# Altium schematic sheet ice40.SchDoc: <Enter Sheet Title>
size Letter; Organization: NewAE Technology Inc.; Address1: 1083 Queen St., Suite 196; Address2: Halifax; Address3: NS; Address4: Canada B3H 0B2; SheetApproved: NO
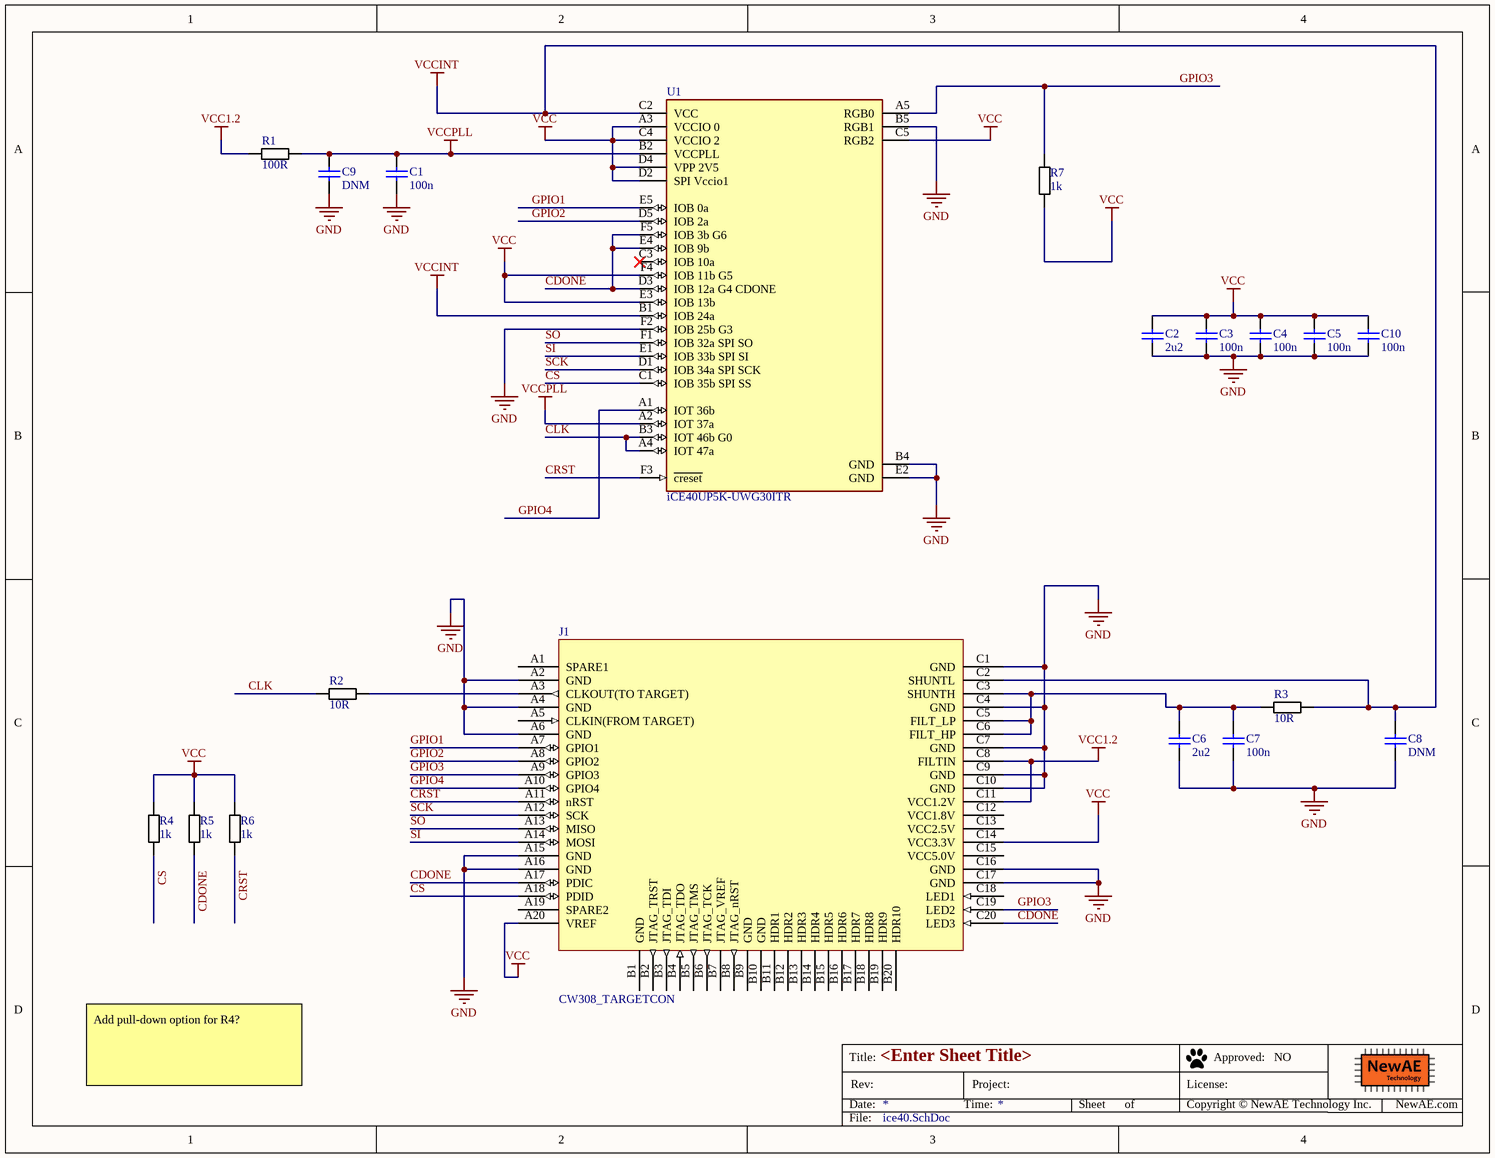
[diagram p0: ice40.SchDoc]

## Parts
C1  100n  [CAPC0603_M]
C2  2u2  [CAPC0603_M]
C3  100n  [CAPC0603_M]
C4  100n  [CAPC0603_M]
C5  100n  [CAPC0603_M]
C6  2u2  [CAPC0603_M]
C7  100n  [CAPC0603_M]
C8  DNM  [CAPC0603_M]
C9  DNM  [CAPC0603_M]
C10  100n  [CAPC0603_M]
J1  CW308_TARGETCON  [CW308_TBOARD_CONN]
R1  100R  [RESC1608X55N]
R2  10R  [RESC1608X55N]
R3  10R  [RESC1608X55N]
R4  1k  [RESC1608X55N]
R5  1k  [RESC1608X55N]
R6  1k  [RESC1608X55N]
R7  1k  [RESC1608X55N]
U1  iCE40UP5K-UWG30ITR  [FP-WLSC-30-MFG]

## Nets
GND: C1.2 C2.2 C3.2 C4.2 C5.2 C6.2 C7.2 C8.2 C9.2 C10.2 J1.A2(GND) J1.A4(GND) J1.A6(GND) J1.A15(GND) J1.A16(GND) J1.C1(GND) J1.C4(GND) J1.C7(GND) J1.C9(GND) J1.C10(GND) J1.C16(GND) J1.C17(GND) U1.B4(GND) U1.B5(RGB1) U1.E2(GND) U1.F2(IOB_25b_G3)
VCC: C2.1 C3.1 C4.1 C5.1 C10.1 J1.A20(VREF) J1.C14(VCC3.3V) R4.1 R5.1 R6.1 R7.2 U1.A3(VCCIO_0) U1.C4(VCCIO_2) U1.C5(RGB2) U1.D2(SPI_Vccio1) U1.D4(VPP_2V5) U1.E3(IOB_13b) U1.F4(IOB_11b_G5)
VCC1.2: J1.C8(FILTIN) J1.C11(VCC1.2V) R1.1
VCCINT: C8.1 J1.C2(SHUNTL) R3.2 U1.B1(IOB_24a) U1.C2(VCC)
VCCPLL: C1.1 C9.1 R1.2 U1.A2(IOT_37a) U1.B2(VCCPLL)
CDONE: J1.A17(PDIC) J1.C20(LED3) R5.2 U1.D3(IOB_12a_G4_CDONE) U1.E4(IOB_9b) U1.F5(IOB_3b_G6)
CLK: R2.1 U1.A4(IOT_47a) U1.B3(IOT_46b_G0)
CRST: J1.A11(nRST) R6.2 U1.F3(~{creset})
CS: J1.A18(PDID) R4.2 U1.C1(IOB_35b_SPI_SS)
GPIO1: J1.A7(GPIO1) U1.E5(IOB_0a)
GPIO2: J1.A8(GPIO2) U1.D5(IOB_2a)
GPIO3: J1.A9(GPIO3) J1.C19(LED2) R7.1 U1.A5(RGB0)
GPIO4: J1.A10(GPIO4) U1.A1(IOT_36b)
SCK: J1.A12(SCK) U1.D1(IOB_34a_SPI_SCK)
SI: J1.A14(MOSI) U1.E1(IOB_33b_SPI_SI)
SO: J1.A13(MISO) U1.F1(IOB_32a_SPI_SO)
NetC6_1: C6.1 C7.1 J1.C3(SHUNTH) J1.C5(FILT_LP) J1.C6(FILT_HP) R3.1
NetJ1_A3: J1.A3(CLKOUT(TO_TARGET)) R2.2

Not connected (* = marked no-connect by the designer): J1 A1(SPARE1) A5(CLKIN(FROM_TARGET)) A19(SPARE2) B1(GND) B2(JTAG_TRST) B3(JTAG_TDI) B4(JTAG_TDO) B5(JTAG_TMS) B6(JTAG_TCK) B7(JTAG_VREF) B8(JTAG_nRST) B9(GND) B10(GND) B11(HDR1) B12(HDR2) B13(HDR3) B14(HDR4) B15(HDR5) B16(HDR6) B17(HDR7) B18(HDR8) B19(HDR9) B20(HDR10) C12(VCC1.8V) C13(VCC2.5V) C15(VCC5.0V) C18(LED1); U1 C3(IOB_10a)*

## Notes on the sheet
- Add pull-down option for R4?
- Title:
- Date:
- Rev:
- Time:
- Project:
- Sheet
- of
- License:
- Copyright © NewAE Technology Inc.
- Approved:
- NewAE.com
- File:

## Library data of the parts
C1 C3-C5 C7 C10 = CCHIP-100n-0603: 100n, 0603; Manufacture 1: Kemet; Manufacture Part Number 1: C0603C104K5RACTU; Component Group: Capacitor; Case-EIA: 0603; Case-Metric: 1608; Rated Voltage: 50VDC; Part Number: CCHIP-100n-0603; Footprint: 0603; Pin Count: 2; Supplier 1: Digi-Key; Supplier Part Number 1: 399-5089-2-ND; Value: 100n; Mounting Technology: SMT; Component Kind: Standard; Component Type: Standard
C2 C6 = CCHIP-2u2-0603: 2u2, 0603; Manufacture 1: Samsung; Manufacture Part Number 1: CL10B225KP8NNNC; Component Group: Capacitor; Case-EIA: 0603; Case-Metric: 1608; Rated Voltage: 10VDC; Part Number: CCHIP-2u2-0603; Footprint: 0603; Pin Count: 2; Supplier 1: Digi-Key; Supplier Part Number 1: 1276-1134-1-ND; Value: 2u2; Mounting Technology: SMT; Component Kind: Standard; Component Type: Standard
C8 C9 = CCHIP-DNM-0603: DNM, 0603; Component Group: Capacitor; Case-EIA: 0603; Part Number: CCHIP-DNM-0603; Footprint: 0603; Pin Count: 2; Value: DNM; Mounting Technology: SMT; Component Kind: Standard; Component Type: Standard
J1 = CW308_TBOARD: CW308 "Standard" Target Board Connector; Component Group: Mechanical; Pitch: 2.54mm; Part Number: CW308_TBOARD; Pin Count: 60; Mounting Technology: Through-hole; Component Kind: Standard; Component Type: Standard
R1 = RCHIP-100R-0603: 100R res, 0603, 1%, 1/10W; Manufacture 1: Yageo; Manufacture Part Number 1: RC0603FR-07100RL; Component Group: Resistor; Case-EIA: 0603; Case-Metric: 1608; Rated Power: 0.1W; Rated Voltage: 75VDC; Part Number: RCHIP-100R-0603; Footprint: 0603; Pin Count: 2; Supplier 1: Digi-Key; Supplier Part Number 1: 311-100HRCT-ND; Value: 100R; Tolerance: 1%; Mounting Technology: SMT; Temperature Range: -55C to 155C; Component Kind: Standard; Component Type: Standard
R2 R3 = RCHIP-10R-0603: 10R res, 0603, 1%, 1/10W; Manufacture 1: Yageo; Manufacture Part Number 1: RC0603FR-0710RL; Component Group: Resistor; Case-EIA: 0603; Case-Metric: 1608; Rated Power: 0.1W; Rated Voltage: 75VDC; Part Number: RCHIP-10R-0603; Footprint: 0603; Pin Count: 2; Supplier 1: Digi-Key; Supplier Part Number 1: 311-10.0HRCT-ND; Value: 10R; Tolerance: 1%; Mounting Technology: SMT; Temperature Range: -55C to 155C; Component Kind: Standard; Component Type: Standard
R4-R7 = RCHIP-1K-0603: 1k res, 0603, 1%, 1/10W; Manufacture 1: Yageo; Manufacture Part Number 1: RC0603FR-071KL; Component Group: Resistor; Case-EIA: 0603; Case-Metric: 1608; Rated Power: 0.1W; Rated Voltage: 75VDC; Part Number: RCHIP-1K-0603; Footprint: 0603; Pin Count: 2; Supplier 1: Digi-Key; Supplier Part Number 1: 311-1.00KHRCT-ND; Value: 1k; Tolerance: 1%; Mounting Technology: SMT; Temperature Range: -55C to 155C; Component Kind: Standard; Component Type: Standard
U1 = CMP-17932-000002-1: CE40-ULTRAPLUS, 5280 LUTS, 1.2V; Manufacturer: Lattice Semiconductor; Frequency: 185MHz; Max Junction Temp: +100°C; Propagation Delay: 9ns; Min Supply Voltage: 1.14V; Standoff Height: 0.14mm; Number Of I/Os: 21; Ram Size: 1024Kbits; Number Of Logic Blocks: 660; Max Supply Voltage: 3.46V; Number Of Logic Elements Cells: 5280; ComponentLink2URL: http://www.latticesemi.com/view_document?document_id=51968; Manufacturer Part Number: iCE40UP5K-UWG30ITR; Device Class L2: Embedded Processors and Controllers; Automotive: No; Octopart: https://octopart.com/ice40up5k-uwg30itr-lattice+semiconductor-75367085; Category: IC; Ipc Land Pattern Name: BGA30N40P5X6_253X211X60; Device Class L3: FPGAs - Field Programmable Gate Arrays; Device Class L1: Integrated Circuits (ICs); Digikey Description: CE40-ULTRAPLUS, 5280 LUTS, 1.2V; Temperature: -40°C to +100°C; Temperature Range Low: -40°C; Lead Free: Yes; Footprint Url: http://www.latticesemi.com/view_document?document_id=213; Height: 0.6mm; Temperature Range High: +100°C; Package: WLSC-30; RoHS: TRUE; ComponentLink2Description: Datasheet